# EAGLE schematic schmitt_rev2 (EAGLE 6.6.0)
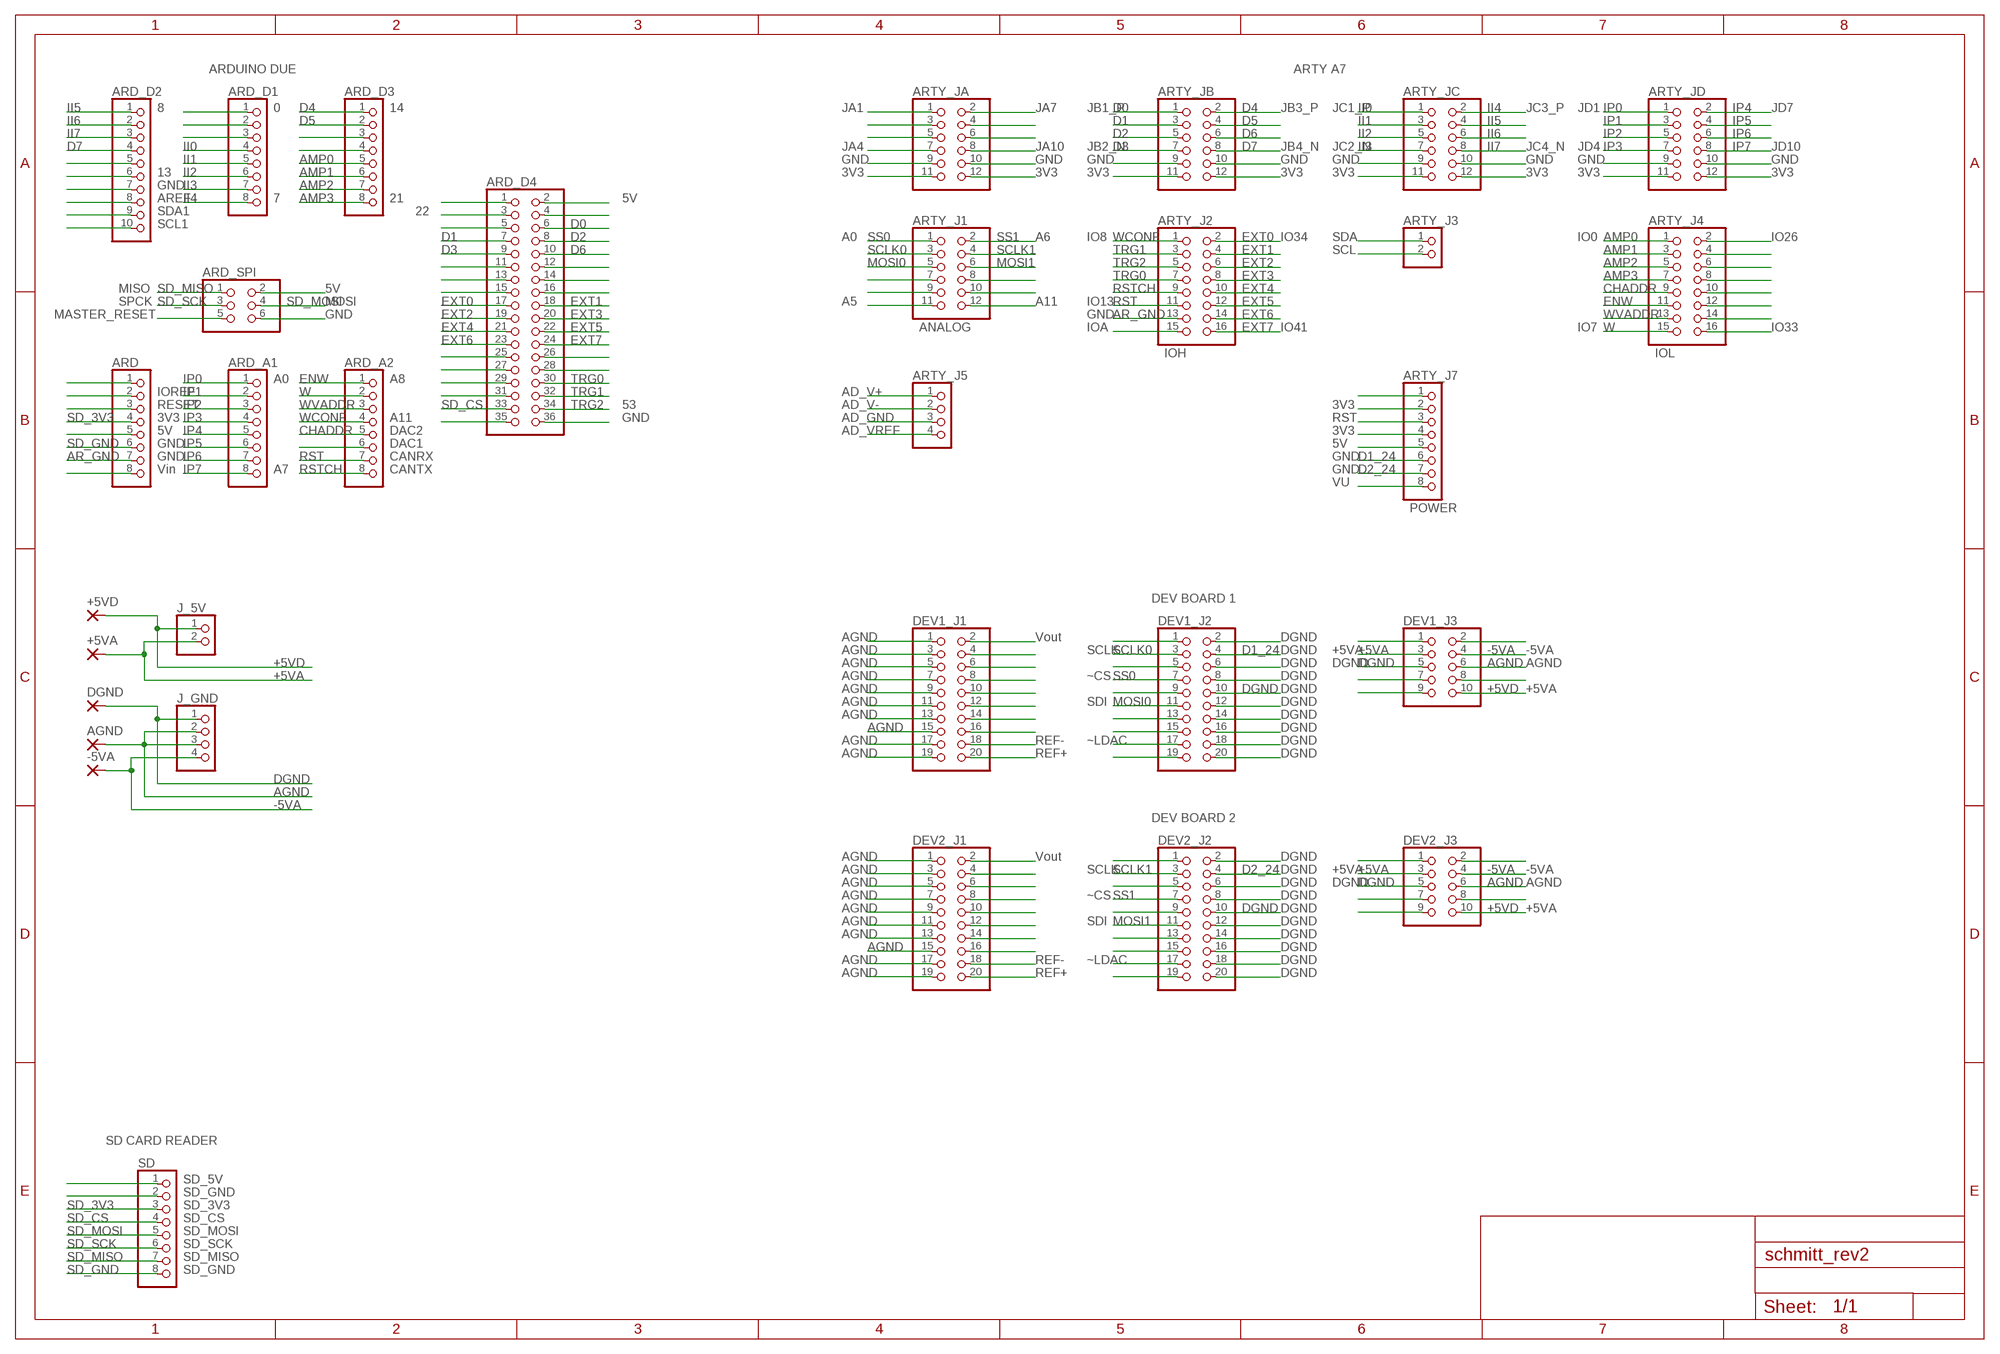
[diagram p0: schematic, sheet 1]

## Parts
+5VA  2,15/1,0  [2,15/1,0]
+5VD  2,15/1,0  [2,15/1,0]
-5VA  2,15/1,0  [2,15/1,0]
AGND  2,15/1,0  [2,15/1,0]
ARD  PINHD-1X8  [1X08]
ARD_A1  PINHD-1X8  [1X08]
ARD_A2  PINHD-1X8  [1X08]
ARD_D1  PINHD-1X8  [1X08]
ARD_D2  PINHD-1X10  [1X10]
ARD_D3  PINHD-1X8  [1X08]
ARD_D4  PINHD-2X18  [2X18]
ARD_SPI  PINHD-2X3  [2X03]
ARTY_J1  PINHD-2X6  [2X06]
ARTY_J2  PINHD-2X8  [2X08]
ARTY_J3  PINHD-1X2  [1X02]
ARTY_J4  PINHD-2X8  [2X08]
ARTY_J5  PINHD-1X4  [1X04]
ARTY_J7  PINHD-1X8  [1X08]
ARTY_JA  PINHD-2X6  [2X06]
ARTY_JB  PINHD-2X6  [2X06]
ARTY_JC  PINHD-2X6  [2X06]
ARTY_JD  PINHD-2X6  [2X06]
DEV1_J1  PINHD-2X10  [2X10]
DEV1_J2  PINHD-2X10  [2X10]
DEV1_J3  PINHD-2X5  [2X05]
DEV2_J1  PINHD-2X10  [2X10]
DEV2_J2  PINHD-2X10  [2X10]
DEV2_J3  PINHD-2X5  [2X05]
DGND  2,15/1,0  [2,15/1,0]
J_5V  PINHD-1X2  [1X02]
J_GND  PINHD-1X4  [1X04]
SD  PINHD-1X8  [1X08]

## Nets
+5VA: +5VA.1(P) DEV1_J3.3 DEV2_J3.3 J_5V.2
+5VD: +5VD.1(P) DEV1_J3.10 DEV2_J3.10 J_5V.1
-5VA: -5VA.1(P) DEV1_J3.4 DEV2_J3.4 J_GND.4
AGND: AGND.1(P) DEV1_J1.15 DEV1_J3.6 DEV2_J1.15 DEV2_J3.6 J_GND.2 J_GND.3
AMP0: ARD_D3.5 ARTY_J4.1
AMP1: ARD_D3.6 ARTY_J4.3
AMP2: ARD_D3.7 ARTY_J4.5
AMP3: ARD_D3.8 ARTY_J4.7
AR_GND: ARD.7 ARTY_J2.13
ARD_SPI: ARD_SPI.6
CHADDR: ARD_A2.5 ARTY_J4.9
D0: ARD_D4.6 ARTY_JB.1
D1: ARD_D4.7 ARTY_JB.3
D1_24: ARTY_J7.6 DEV1_J2.4
D2: ARD_D4.8 ARTY_JB.5
D2_24: ARTY_J7.7 DEV2_J2.4
D3: ARD_D4.9 ARTY_JB.7
D4: ARD_D3.1 ARTY_JB.2
D5: ARD_D3.2 ARTY_JB.4
D6: ARD_D4.10 ARTY_JB.6
D7: ARD_D2.4 ARTY_JB.8
DGND: DEV1_J2.10 DEV1_J3.5 DEV2_J2.10 DEV2_J3.5 DGND.1(P) J_GND.1
ENW: ARD_A2.1 ARTY_J4.11
EXT0: ARD_D4.17 ARTY_J2.2
EXT1: ARD_D4.18 ARTY_J2.4
EXT2: ARD_D4.19 ARTY_J2.6
EXT3: ARD_D4.20 ARTY_J2.8
EXT4: ARD_D4.21 ARTY_J2.10
EXT5: ARD_D4.22 ARTY_J2.12
EXT6: ARD_D4.23 ARTY_J2.14
EXT7: ARD_D4.24 ARTY_J2.16
II0: ARD_D1.4 ARTY_JC.1
II1: ARD_D1.5 ARTY_JC.3
II2: ARD_D1.6 ARTY_JC.5
II3: ARD_D1.7 ARTY_JC.7
II4: ARD_D1.8 ARTY_JC.2
II5: ARD_D2.1 ARTY_JC.4
II6: ARD_D2.2 ARTY_JC.6
II7: ARD_D2.3 ARTY_JC.8
IP0: ARD_A1.1 ARTY_JD.1
IP1: ARD_A1.2 ARTY_JD.3
IP2: ARD_A1.3 ARTY_JD.5
IP3: ARD_A1.4 ARTY_JD.7
IP4: ARD_A1.5 ARTY_JD.2
IP5: ARD_A1.6 ARTY_JD.4
IP6: ARD_A1.7 ARTY_JD.6
IP7: ARD_A1.8 ARTY_JD.8
MOSI0: ARTY_J1.5 DEV1_J2.11
MOSI1: ARTY_J1.6 DEV2_J2.11
N$1: DEV1_J1.1
N$2: SD.2
N$8: DEV1_J1.2
N$9: ARD_D2.10
N$11: SD.1
N$13: ARD_D2.5
N$14: ARD_D2.6
N$15: ARD_D2.7
N$16: ARD_D2.8
N$17: ARD_D2.9
N$20: ARD_D1.2
N$21: ARD_D1.3
N$26: ARD_D1.1
N$31: ARD_D3.4
N$32: ARD_D3.3
N$35: ARD_SPI.2
N$37: ARD_SPI.5
N$38: ARTY_J7.8
N$40: DEV1_J2.1
N$41: ARTY_J1.8
N$42: ARTY_J1.10
N$43: ARTY_J1.12
N$46: ARTY_J1.11
N$47: ARD_D4.1
N$48: ARD_D4.3
N$49: ARD_D4.5
N$52: ARD_D4.11
N$53: ARD_D4.13
N$54: ARD_D4.15
N$59: ARD_D4.25
N$60: ARD_D4.27
N$61: ARD_D4.29
N$62: ARD_D4.31
N$64: ARD_D4.35
N$65: ARD_D4.2
N$66: ARD_D4.4
N$70: ARD_D4.12
N$71: ARD_D4.14
N$72: ARD_D4.16
N$77: ARD_D4.26
N$78: ARD_D4.28
N$82: ARD_D4.36
N$83: DEV1_J2.2
N$88: ARD_A2.6
N$90: DEV1_J3.1
N$99: ARD.8
N$100: ARD.2
N$101: ARD.3
N$103: ARD.5
N$106: ARD.1
N$107: ARTY_J1.9
N$108: ARTY_J1.7
N$109: DEV1_J3.2
N$110: ARTY_JA.1
N$111: ARTY_JA.2
N$114: ARTY_J4.2
N$116: ARTY_J3.1
N$119: ARTY_J5.1
N$120: ARTY_J7.1
N$122: ARTY_JB.9
N$123: ARTY_JB.11
N$128: ARTY_JB.10
N$129: ARTY_JB.12
N$131: ARTY_JA.4
N$132: ARTY_JA.6
N$133: ARTY_JA.8
N$134: ARTY_JA.10
N$135: ARTY_JA.12
N$136: ARTY_JA.11
N$137: ARTY_JA.9
N$138: ARTY_JA.7
N$139: ARTY_JA.5
N$140: ARTY_JA.3
N$146: ARTY_JD.10
N$147: ARTY_JD.12
N$148: ARTY_JD.11
N$149: ARTY_JD.9
N$158: ARTY_JC.10
N$159: ARTY_JC.12
N$160: ARTY_JC.11
N$161: ARTY_JC.9
N$167: ARTY_J2.15
N$177: ARTY_J3.2
N$187: ARTY_J4.4
N$188: ARTY_J4.6
N$189: ARTY_J4.8
N$190: ARTY_J4.10
N$191: ARTY_J4.12
N$192: ARTY_J4.14
N$193: ARTY_J4.16
N$195: ARTY_J5.2
N$196: ARTY_J5.3
N$197: ARTY_J5.4
N$205: ARTY_J7.2
N$206: ARTY_J7.3
N$207: ARTY_J7.4
N$208: ARTY_J7.5
N$213: DEV1_J1.3
N$214: DEV1_J1.5
N$215: DEV1_J1.7
N$216: DEV1_J1.9
N$217: DEV1_J1.11
N$218: DEV1_J1.13
N$220: DEV1_J1.17
N$221: DEV1_J1.19
N$222: DEV1_J1.20
N$223: DEV1_J1.18
N$224: DEV1_J1.16
N$225: DEV1_J1.14
N$226: DEV1_J1.12
N$227: DEV1_J1.10
N$228: DEV1_J1.8
N$229: DEV1_J1.6
N$230: DEV1_J1.4
N$234: DEV1_J2.5
N$236: DEV1_J2.9
N$238: DEV1_J2.13
N$239: DEV1_J2.15
N$240: DEV1_J2.17
N$241: DEV1_J2.19
N$242: DEV1_J2.20
N$243: DEV1_J2.18
N$244: DEV1_J2.16
N$245: DEV1_J2.14
N$246: DEV1_J2.12
N$248: DEV1_J2.8
N$249: DEV1_J2.6
N$255: DEV1_J3.7
N$256: DEV1_J3.9
N$260: DEV1_J3.8
N$262: DEV2_J1.1
N$263: DEV2_J1.3
N$264: DEV2_J1.5
N$265: DEV2_J1.7
N$266: DEV2_J1.9
N$267: DEV2_J1.11
N$268: DEV2_J1.13
N$270: DEV2_J1.17
N$271: DEV2_J1.19
N$272: DEV2_J1.20
N$273: DEV2_J1.18
N$274: DEV2_J1.16
N$275: DEV2_J1.14
N$276: DEV2_J1.12
N$277: DEV2_J1.10
N$278: DEV2_J1.8
N$279: DEV2_J1.6
N$280: DEV2_J1.4
N$281: DEV2_J1.2
N$282: DEV2_J2.1
N$284: DEV2_J2.5
N$286: DEV2_J2.9
N$288: DEV2_J2.13
N$289: DEV2_J2.15
N$290: DEV2_J2.17
N$291: DEV2_J2.19
N$292: DEV2_J2.20
N$293: DEV2_J2.18
N$294: DEV2_J2.16
N$295: DEV2_J2.14
N$296: DEV2_J2.12
N$298: DEV2_J2.8
N$299: DEV2_J2.6
N$301: DEV2_J2.2
N$302: DEV2_J3.1
N$305: DEV2_J3.7
N$306: DEV2_J3.9
N$307: DEV2_J3.2
N$310: DEV2_J3.8
RST: ARD_A2.7 ARTY_J2.11
RSTCH: ARD_A2.8 ARTY_J2.9
SCLK0: ARTY_J1.3 DEV1_J2.3
SCLK1: ARTY_J1.4 DEV2_J2.3
SD_3V3: ARD.4 SD.3
SD_CS: ARD_D4.33 SD.4
SD_GND: ARD.6 SD.8
SD_MISO: ARD_SPI.1 SD.7
SD_MOSI: ARD_SPI.4 SD.5
SD_SCK: ARD_SPI.3 SD.6
SS0: ARTY_J1.1 DEV1_J2.7
SS1: ARTY_J1.2 DEV2_J2.7
TRG0: ARD_D4.30 ARTY_J2.7
TRG1: ARD_D4.32 ARTY_J2.3
TRG2: ARD_D4.34 ARTY_J2.5
W: ARD_A2.2 ARTY_J4.15
WCONF: ARD_A2.4 ARTY_J2.1
WVADDR: ARD_A2.3 ARTY_J4.13

## Notes on the sheet
- ARDUINO DUE | ARTY A7
- 8 | 0 | 14 | JA1 | JA7 | JB1_P | JB3_P | JC1_P | JC3_P | JD1 | JD7
- JA4 | JA10 | JB2_N | JB4_N | JC2_N | JC4_N | JD4 | JD10
- GND | GND | GND | GND | GND | GND | GND | GND
- 13 | 3V3 | 3V3 | 3V3 | 3V3 | 3V3 | 3V3 | 3V3 | 3V3
- GND
- AREF | 7 | 21 | 5V
- SDA1 | 22
- SCL1
- A0 | A6 | IO8 | IO34 | SDA | IO0 | IO26
- SCL
- MISO | 5V
- SPCK | MOSI | A5 | A11 | IO13
- MASTER_RESET | GND | GND
- ANALOG | IOA | IO41 | IO7 | IO33
- IOH | IOL
- A0 | A8
- IOREF | AD_V+
- RESET | 53 | AD_V- | 3V3
- 3V3 | A11 | GND | AD_GND | RST
- 5V | DAC2 | AD_VREF | 3V3
- GND | DAC1 | 5V
- GND | CANRX | GND
- Vin | A7 | CANTX | GND
- VU
- POWER
- DEV BOARD 1
- AGND | Vout | DGND
- AGND | SCLK | DGND | +5VA | -5VA
- AGND | DGND | DGND | AGND
- AGND | ~CS | DGND
- AGND | DGND | +5VA
- AGND | SDI | DGND
- AGND | DGND
- DGND
- AGND | REF- | ~LDAC | DGND
- AGND | REF+ | DGND
- DEV BOARD 2
- AGND | Vout | DGND
- AGND | SCLK | DGND | +5VA | -5VA
- AGND | DGND | DGND | AGND
- AGND | ~CS | DGND
- AGND | DGND | +5VA
- AGND | SDI | DGND
- AGND | DGND
- DGND
- AGND | REF- | ~LDAC | DGND
- AGND | REF+ | DGND
- SD CARD READER
- SD_5V
- SD_GND
- SD_3V3
- SD_CS
- SD_MOSI
- SD_SCK
- SD_MISO
- SD_GND

## Library data of the parts
+5VA +5VD -5VA AGND DGND = wirepad:2,15/1,0: THROUGH-HOLE PAD
ARD ARD_A1 ARD_A2 ARD_D1 ARD_D3 ARTY_J7 SD = pinhead:PINHD-1X8: PIN HEADER
ARD_D2 = pinhead:PINHD-1X10: PIN HEADER
ARD_D4 = pinhead:PINHD-2X18: PIN HEADER
ARD_SPI = pinhead:PINHD-2X3: PIN HEADER
ARTY_J1 ARTY_JA ARTY_JB ARTY_JC ARTY_JD = pinhead:PINHD-2X6: PIN HEADER
ARTY_J2 ARTY_J4 = pinhead:PINHD-2X8: PIN HEADER
ARTY_J3 J_5V = pinhead:PINHD-1X2: PIN HEADER
ARTY_J5 J_GND = pinhead:PINHD-1X4: PIN HEADER
DEV1_J1 DEV1_J2 DEV2_J1 DEV2_J2 = pinhead:PINHD-2X10: PIN HEADER
DEV1_J3 DEV2_J3 = pinhead:PINHD-2X5: PIN HEADER